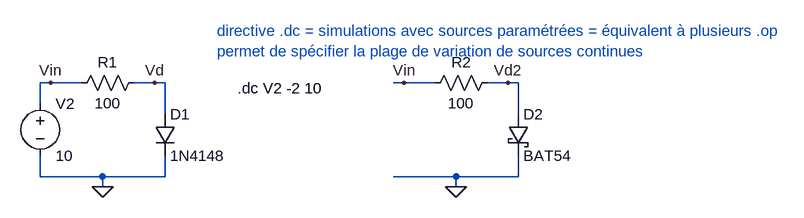
[diagram p0: schematic Releve V-I diode.asc]
Releve V-I diode.asc, the LTspice schematic file:
Version 4
SHEET 1 1744 680
WIRE 16 96 0 96
WIRE 64 96 16 96
WIRE 176 96 144 96
WIRE 192 96 176 96
WIRE 560 96 544 96
WIRE 608 96 560 96
WIRE 720 96 688 96
WIRE 736 96 720 96
WIRE 0 128 0 96
WIRE 192 144 192 96
WIRE 736 144 736 96
WIRE 0 240 0 208
WIRE 96 240 0 240
WIRE 192 240 192 208
WIRE 192 240 96 240
WIRE 640 240 544 240
WIRE 736 240 736 208
WIRE 736 240 640 240
WIRE 96 256 96 240
WIRE 640 256 640 240
FLAG 96 256 0
FLAG 176 96 Vd
FLAG 16 96 Vin
FLAG 640 256 0
FLAG 720 96 Vd2
FLAG 560 96 Vin
SYMBOL diode 176 144 R0
SYMATTR InstName D1
SYMATTR Value 1N4148
SYMBOL res 160 80 R90
WINDOW 0 0 56 VBottom 2
WINDOW 3 32 56 VTop 2
SYMATTR InstName R1
SYMATTR Value 100
SYMBOL voltage 0 112 R0
SYMATTR InstName V2
SYMATTR Value 10
SYMBOL schottky 720 144 R0
SYMATTR InstName D2
SYMATTR Value BAT54
SYMATTR Description Diode
SYMATTR Type diode
SYMBOL res 704 80 R90
WINDOW 0 0 56 VBottom 2
WINDOW 3 32 56 VTop 2
SYMATTR InstName R2
SYMATTR Value 100
TEXT 304 104 Left 2 !.dc V2 -2 10
TEXT 272 16 Left 2 ;directive .dc = simulations avec sources paramétrées = équivalent à plusieurs .op\npermet de spécifier la plage de variation de sources continues

The netlist it stands for:
* Releve V-I diode.asc
D1 Vd 0 1N4148
R1 Vd Vin 100
V2 Vin 0 10
D2 Vd2 0 BAT54
R2 Vd2 Vin 100
.model D D
.lib standard.dio
.dc V2 -2 10
* directive .dc = simulations avec sources paramétrées = équivalent à plusieurs .op
* permet de spécifier la plage de variation de sources continues
.backanno
.end

* Results of the author's LTspice run, read from the files saved beside the schematic
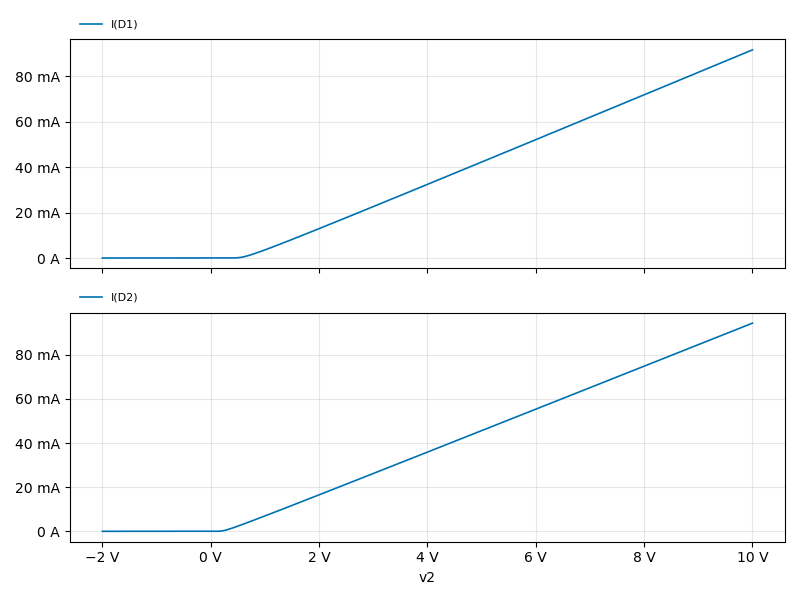
[diagram p1: DC transfer characteristic of Releve V-I diode.asc, plotted from the saved traces]
* DC transfer characteristic, 1 run:
*   I(D1): -2.522 nA at v2=-2 V, 91.59 mA at v2=10 V, min -2.522 nA, max 91.59 mA
*   I(D2): -100 nA at v2=-2 V, 94.37 mA at v2=10 V, min -100 nA, max 94.37 mA